# Altium project PSLink.PrjPcb (part 3 of 3)

## Sheet FMC.SchDoc
size 420 x 297 mm; SheetNumber: 3; SheetTotal: 6
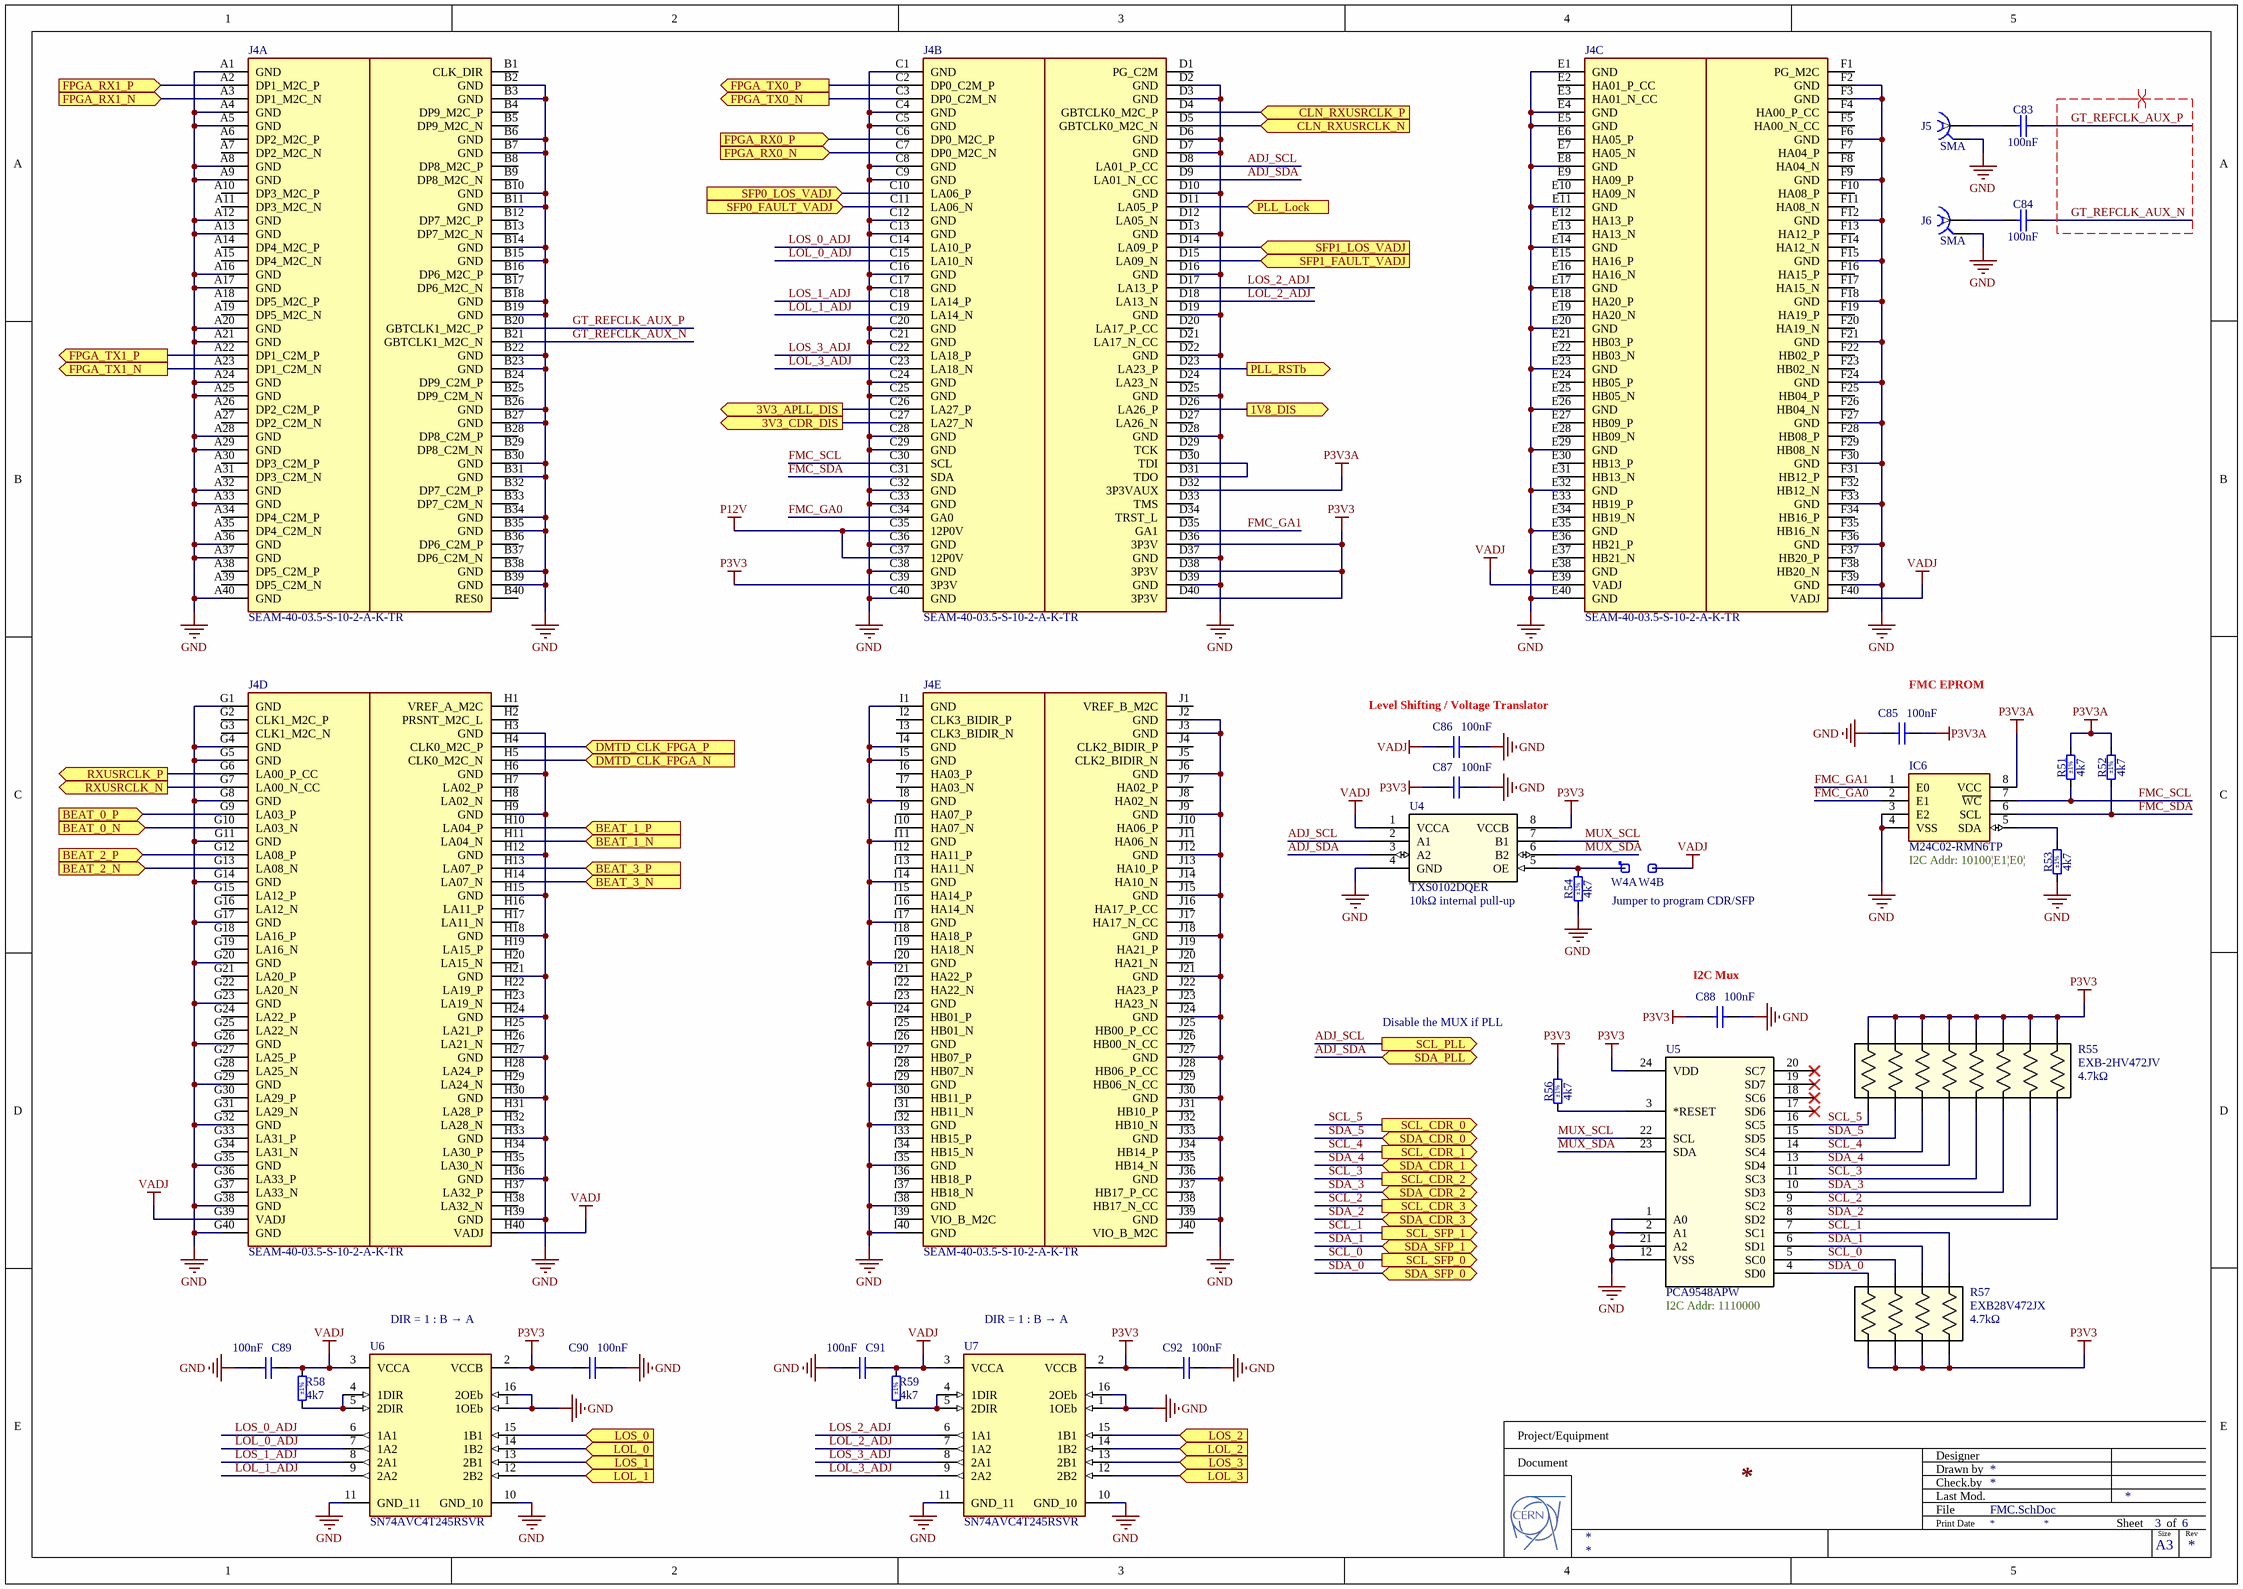
[diagram p5: FMC.SchDoc]

### Parts
C83  100nF  [CAPC0603X33N]
C84  100nF  [CAPC0603X33N]
C85  100nF  [CAPC0603X33N]
C86  100nF  [CAPC0603X33N]
C87  100nF  [CAPC0603X33N]
C88  100nF  [CAPC0603X33N]
C89  100nF  [CAPC0603X33N]
C90  100nF  [CAPC0603X33N]
C91  100nF  [CAPC0603X33N]
C92  100nF  [CAPC0603X33N]
IC6  M24C02-RMN6TP  [SOIC127P600X175-8N]
J4  SEAM-40-03.5-S-10-2-A-K-TR  [SAMTEC_SEAM-40-03.5-S-10-2-A-K-TR]  (parts A,B,C,D,E of 5)
J5  SMA  [SAMTEC_SMA-J-P-H-ST-MT1]
J6  SMA  [SAMTEC_SMA-J-P-H-ST-MT1]
R51  4k7  Tolerance: ±1%  [RESC1005X40N]
R52  4k7  Tolerance: ±1%  [RESC1005X40N]
R53  4k7  Tolerance: ±1%  [RESC1005X40N]
R54  4k7  Tolerance: ±1%  [RESC1005X40N]
R55  EXB-2HV472JV  [RES_EXB2HV]
R56  4k7  Tolerance: ±1%  [RESC1005X40N]
R57  EXB28V472JX  [C_ARRAY_EXB28V_PAN]
R58  4k7  Tolerance: ±1%  [RESC1005X40N]
R59  4k7  Tolerance: ±1%  [RESC1005X40N]
U4  TXS0102DQER  [DQE8_TEX]
U5  PCA9548APW  [SOT355-1_NXP]
U6  SN74AVC4T245RSVR  [QFN40P260X180X55-16N]
U7  SN74AVC4T245RSVR  [QFN40P260X180X55-16N]
W4  Header 2  [SAMTEC_HTSW-102-23-L-S]  (value not drawn)  (parts A,B of 2)

### Ports
1V8_DIS (out), 3V3_APLL_DIS (out), 3V3_CDR_DIS (out), BEAT_0_N (in), BEAT_0_P (in), BEAT_1_N (in), BEAT_1_P (in), BEAT_2_N (in), BEAT_2_P (in), BEAT_3_N (in), BEAT_3_P (in), CLN_RXUSRCLK_N (in), CLN_RXUSRCLK_P (in), DMTD_CLK_FPGA_N (in), DMTD_CLK_FPGA_P (in), FPGA_RX0_N (in), FPGA_RX0_P (in), FPGA_RX1_N (in), FPGA_RX1_P (in), FPGA_TX0_N (out), FPGA_TX0_P (out), FPGA_TX1_N (out), FPGA_TX1_P (out), LOL_0 (in), LOL_1 (in), LOL_2 (in), LOL_3 (in), LOS_0 (in), LOS_1 (in), LOS_2 (in), LOS_3 (in), PLL_Lock (in), PLL_RSTb (out), RXUSRCLK_N (out), RXUSRCLK_P (out), SCL_CDR_0 (out), SCL_CDR_1 (out), SCL_CDR_2 (out), SCL_CDR_3 (out), SCL_PLL (out), SCL_SFP_0 (out), SCL_SFP_1 (out), SDA_CDR_0 (bidir), SDA_CDR_1 (bidir), SDA_CDR_2 (bidir), SDA_CDR_3 (bidir), SDA_PLL (bidir), SDA_SFP_0 (bidir), SDA_SFP_1 (bidir), SFP0_FAULT_VADJ (in), SFP0_LOS_VADJ (in), SFP1_FAULT_VADJ (in), SFP1_LOS_VADJ (in)

### Nets
GND: C85.1 C86.1 C87.1 C88.1 C89.1 C90.1 C91.1 C92.1 IC6.3(E2) IC6.4(VSS) J4.A1(GND) J4.A4(GND) J4.A5(GND) J4.A8(GND) J4.A9(GND) J4.A12(GND) J4.A13(GND) J4.A16(GND) J4.A17(GND) J4.A20(GND) J4.A21(GND) J4.A24(GND) J4.A25(GND) J4.A28(GND) J4.A29(GND) J4.A32(GND) J4.A33(GND) J4.A36(GND) J4.A37(GND) J4.A40(GND) J4.B2(GND) J4.B3(GND) J4.B6(GND) J4.B7(GND) J4.B10(GND) J4.B11(GND) J4.B14(GND) J4.B15(GND) J4.B18(GND) J4.B19(GND) J4.B22(GND) J4.B23(GND) J4.B26(GND) J4.B27(GND) J4.B30(GND) J4.B31(GND) J4.B34(GND) J4.B35(GND) J4.B38(GND) J4.B39(GND) J4.C1(GND) J4.C4(GND) J4.C5(GND) J4.C8(GND) J4.C9(GND) J4.C12(GND) J4.C13(GND) J4.C16(GND) J4.C17(GND) J4.C20(GND) J4.C21(GND) J4.C24(GND) J4.C25(GND) J4.C28(GND) J4.C29(GND) J4.C32(GND) J4.C33(GND) J4.C36(GND) J4.C38(GND) J4.C40(GND) J4.D2(GND) J4.D3(GND) J4.D6(GND) J4.D7(GND) J4.D10(GND) J4.D13(GND) J4.D16(GND) J4.D19(GND) J4.D22(GND) J4.D25(GND) J4.D28(GND) J4.D37(GND) J4.D39(GND) J4.E1(GND) J4.E4(GND) J4.E5(GND) J4.E8(GND) J4.E11(GND) J4.E14(GND) J4.E17(GND) J4.E20(GND) J4.E23(GND) J4.E26(GND) J4.E29(GND) J4.E32(GND) J4.E35(GND) J4.E38(GND) J4.E40(GND) J4.F2(GND) J4.F3(GND) J4.F6(GND) J4.F9(GND) J4.F12(GND) J4.F15(GND) J4.F18(GND) J4.F21(GND) J4.F24(GND) J4.F27(GND) J4.F30(GND) J4.F33(GND) J4.F36(GND) J4.F39(GND) J4.G1(GND) J4.G4(GND) J4.G5(GND) J4.G8(GND) J4.G11(GND) J4.G14(GND) J4.G17(GND) J4.G20(GND) J4.G23(GND) J4.G26(GND) J4.G29(GND) J4.G32(GND) J4.G35(GND) J4.G38(GND) J4.G40(GND) J4.H3(GND) J4.H6(GND) J4.H9(GND) J4.H12(GND) J4.H15(GND) J4.H18(GND) J4.H21(GND) J4.H24(GND) J4.H27(GND) J4.H30(GND) J4.H33(GND) J4.H36(GND) J4.H39(GND) J4.I1(GND) J4.I4(GND) J4.I5(GND) J4.I8(GND) J4.I11(GND) J4.I14(GND) J4.I17(GND) J4.I20(GND) J4.I23(GND) J4.I26(GND) J4.I29(GND) J4.I32(GND) J4.I35(GND) J4.I38(GND) J4.I40(GND) J4.J2(GND) J4.J3(GND) J4.J6(GND) J4.J9(GND) J4.J12(GND) J4.J15(GND) J4.J18(GND) J4.J21(GND) J4.J24(GND) J4.J27(GND) J4.J30(GND) J4.J33(GND) J4.J36(GND) J4.J39(GND) J5.2 J6.2 R53.1 R54.1 U4.4(GND) U5.1(A0) U5.2(A1) U5.12(VSS) U5.21(A2) U6.1(1OEb) U6.10(GND_10) U6.11(GND_11) U6.16(2OEb) U7.1(1OEb) U7.10(GND_10) U7.11(GND_11) U7.16(2OEb)
P3V3: C87.2 C88.2 C90.2 C92.2 J4.C39(3P3V) J4.D36(3P3V) J4.D38(3P3V) J4.D40(3P3V) R55.9 R55.10 R55.11 R55.12 R55.13 R55.14 R55.15 R55.16 R56.2 R57.1 R57.2 R57.3 R57.4 U4.8(VCCB) U5.24(VDD) U6.2(VCCB) U7.2(VCCB)
P3V3A: C85.2 IC6.8(VCC) J4.D32(3P3VAUX) R51.2 R52.2
P12V: J4.C35(12P0V) J4.C37(12P0V)
VADJ: C86.2 C89.2 C91.2 J4.E39(VADJ) J4.F40(VADJ) J4.G39(VADJ) J4.H40(VADJ) R58.2 R59.2 U4.1(VCCA) U6.3(VCCA) U7.3(VCCA) W4.2
1V8_DIS: J4.D26(LA26_P) ; port 1V8_DIS
3V3_APLL_DIS: J4.C26(LA27_P) ; port 3V3_APLL_DIS
3V3_CDR_DIS: J4.C27(LA27_N) ; port 3V3_CDR_DIS
ADJ_SCL: J4.D8(LA01_P_CC) U4.2(A1) ; port SCL_PLL
ADJ_SDA: J4.D9(LA01_N_CC) U4.3(A2) ; port SDA_PLL
BEAT_0_N: J4.G10(LA03_N) ; port BEAT_0_N
BEAT_0_P: J4.G9(LA03_P) ; port BEAT_0_P
BEAT_1_N: J4.H11(LA04_N) ; port BEAT_1_N
BEAT_1_P: J4.H10(LA04_P) ; port BEAT_1_P
BEAT_2_N: J4.G13(LA08_N) ; port BEAT_2_N
BEAT_2_P: J4.G12(LA08_P) ; port BEAT_2_P
BEAT_3_N: J4.H14(LA07_N) ; port BEAT_3_N
BEAT_3_P: J4.H13(LA07_P) ; port BEAT_3_P
CLN_RXUSRCLK_N: J4.D5(GBTCLK0_M2C_N) ; port CLN_RXUSRCLK_N
CLN_RXUSRCLK_P: J4.D4(GBTCLK0_M2C_P) ; port CLN_RXUSRCLK_P
DMTD_CLK_FPGA_N: J4.H5(CLK0_M2C_N) ; port DMTD_CLK_FPGA_N
DMTD_CLK_FPGA_P: J4.H4(CLK0_M2C_P) ; port DMTD_CLK_FPGA_P
FMC_GA0: IC6.2(E1) J4.C34(GA0)
FMC_GA1: IC6.1(E0) J4.D35(GA1)
FMC_SCL: IC6.7(~{WC}) J4.C30(SCL) R51.1
FMC_SDA: IC6.6(SCL) J4.C31(SDA) R52.1
FPGA_RX0_N: J4.C7(DP0_M2C_N) ; port FPGA_RX0_N
FPGA_RX0_P: J4.C6(DP0_M2C_P) ; port FPGA_RX0_P
FPGA_RX1_N: J4.A3(DP1_M2C_N) ; port FPGA_RX1_N
FPGA_RX1_P: J4.A2(DP1_M2C_P) ; port FPGA_RX1_P
FPGA_TX0_N: J4.C3(DP0_C2M_N) ; port FPGA_TX0_N
FPGA_TX0_P: J4.C2(DP0_C2M_P) ; port FPGA_TX0_P
FPGA_TX1_N: J4.A23(DP1_C2M_N) ; port FPGA_TX1_N
FPGA_TX1_P: J4.A22(DP1_C2M_P) ; port FPGA_TX1_P
GT_REFCLK_AUX_N: C84.1 J4.B21(GBTCLK1_M2C_N)
GT_REFCLK_AUX_P: C83.1 J4.B20(GBTCLK1_M2C_P)
Lock: J4.D11(LA05_P) ; port PLL_Lock
LOL: U7.13(2B1) ; port LOS_3
LOL: U7.15(1B1) ; port LOS_2  [a separate net that carries the same name]
LOL: U6.13(2B1) ; port LOS_1  [a separate net that carries the same name]
LOL: U6.15(1B1) ; port LOS_0  [a separate net that carries the same name]
LOL_0: U6.14(1B2) ; port LOL_0
LOL_0_ADJ: J4.C15(LA10_N) U6.7(1A2)
LOL_1: U6.12(2B2) ; port LOL_1
LOL_1_ADJ: J4.C19(LA14_N) U6.9(2A2)
LOL_2: U7.14(1B2) ; port LOL_2
LOL_2_ADJ: J4.D18(LA13_N) U7.7(1A2)
LOL_3: U7.12(2B2) ; port LOL_3
LOL_3_ADJ: J4.C23(LA18_N) U7.9(2A2)
LOS_0_ADJ: J4.C14(LA10_P) U6.6(1A1)
LOS_1_ADJ: J4.C18(LA14_P) U6.8(2A1)
LOS_2_ADJ: J4.D17(LA13_P) U7.6(1A1)
LOS_3_ADJ: J4.C22(LA18_P) U7.8(2A1)
MUX_SCL: U4.7(B1) U5.22(SCL)
MUX_SDA: U4.6(B2) U5.23(SDA)
PLL_RSTb: J4.D23(LA23_P) ; port PLL_RSTb
RXUSRCLK_N: J4.G7(LA00_N_CC) ; port RXUSRCLK_N
RXUSRCLK_P: J4.G6(LA00_P_CC) ; port RXUSRCLK_P
SCL_0: R57.7 U5.5(SC0) ; port SCL_SFP_0  [project net SCL0]
SCL_1: R57.5 U5.7(SC1) ; port SCL_SFP_1  [project net SCL1]
SCL_2: R55.7 U5.9(SC2) ; port SCL_CDR_3
SCL_3: R55.5 U5.11(SC3) ; port SCL_CDR_2
SCL_4: R55.3 U5.14(SC4) ; port SCL_CDR_1
SCL_5: R55.1 U5.16(SC5) ; port SCL_CDR_0
SDA_0: R57.8 U5.4(SD0) ; port SDA_SFP_0  [project net SDA0]
SDA_1: R57.6 U5.6(SD1) ; port SDA_SFP_1  [project net SDA1]
SDA_2: R55.8 U5.8(SD2) ; port SDA_CDR_3
SDA_3: R55.6 U5.10(SD3) ; port SDA_CDR_2
SDA_4: R55.4 U5.13(SD4) ; port SDA_CDR_1
SDA_5: R55.2 U5.15(SD5) ; port SDA_CDR_0
SFP0_FAULT_VADJ: J4.C11(LA06_N) ; port SFP0_FAULT_VADJ
SFP0_LOS_VADJ: J4.C10(LA06_P) ; port SFP0_LOS_VADJ
SFP1_FAULT_VADJ: J4.D15(LA09_N) ; port SFP1_FAULT_VADJ
SFP1_LOS_VADJ: J4.D14(LA09_P) ; port SFP1_LOS_VADJ
NetC83_2: C83.2 J5.1
NetC84_2: C84.2 J6.1
NetIC6_5: IC6.5(SDA) R53.2
NetJ4_D30: J4.D30(TDI) J4.D31(TDO)
NetR54_2: R54.2 U4.5(OE) W4.1
NetR56_1: R56.1 U5.3(*RESET)
NetR58_1: R58.1 U6.4(1DIR) U6.5(2DIR)
NetR59_1: R59.1 U7.4(1DIR) U7.5(2DIR)

Not connected (* = marked no-connect by the designer): J4 A6(DP2_M2C_P) A7(DP2_M2C_N) A10(DP3_M2C_P) A11(DP3_M2C_N) A14(DP4_M2C_P) A15(DP4_M2C_N) A18(DP5_M2C_P) A19(DP5_M2C_N) A26(DP2_C2M_P) A27(DP2_C2M_N) A30(DP3_C2M_P) A31(DP3_C2M_N) A34(DP4_C2M_P) A35(DP4_C2M_N) A38(DP5_C2M_P) A39(DP5_C2M_N) B1(CLK_DIR) B4(DP9_M2C_P) B5(DP9_M2C_N) B8(DP8_M2C_P) B9(DP8_M2C_N) B12(DP7_M2C_P) B13(DP7_M2C_N) B16(DP6_M2C_P) B17(DP6_M2C_N) B24(DP9_C2M_P) B25(DP9_C2M_N) B28(DP8_C2M_P) B29(DP8_C2M_N) B32(DP7_C2M_P) B33(DP7_C2M_N) B36(DP6_C2M_P) B37(DP6_C2M_N) B40(RES0) D1(PG_C2M) D12(LA05_N) D20(LA17_P_CC) D21(LA17_N_CC) D24(LA23_N) D27(LA26_N) D29(TCK) D33(TMS) D34(TRST_L) E2(HA01_P_CC) E3(HA01_N_CC) E6(HA05_P) E7(HA05_N) E9(HA09_P) E10(HA09_N) E12(HA13_P) E13(HA13_N) E15(HA16_P) E16(HA16_N) E18(HA20_P) E19(HA20_N) E21(HB03_P) E22(HB03_N) E24(HB05_P) E25(HB05_N) E27(HB09_P) E28(HB09_N) E30(HB13_P) E31(HB13_N) E33(HB19_P) E34(HB19_N) E36(HB21_P) E37(HB21_N) F1(PG_M2C) F4(HA00_P_CC) F5(HA00_N_CC) F7(HA04_P) F8(HA04_N) F10(HA08_P) F11(HA08_N) F13(HA12_P) F14(HA12_N) F16(HA15_P) F17(HA15_N) F19(HA19_P) F20(HA19_N) F22(HB02_P) F23(HB02_N) F25(HB04_P) F26(HB04_N) F28(HB08_P) F29(HB08_N) F31(HB12_P) F32(HB12_N) F34(HB16_P) F35(HB16_N) F37(HB20_P) F38(HB20_N) G2(CLK1_M2C_P) G3(CLK1_M2C_N) G15(LA12_P) G16(LA12_N) G18(LA16_P) G19(LA16_N) G21(LA20_P) G22(LA20_N) G24(LA22_P) G25(LA22_N) G27(LA25_P) G28(LA25_N) G30(LA29_P) G31(LA29_N) G33(LA31_P) G34(LA31_N) G36(LA33_P) G37(LA33_N) H1(VREF_A_M2C) H2(PRSNT_M2C_L) H7(LA02_P) H8(LA02_N) H16(LA11_P) H17(LA11_N) H19(LA15_P) H20(LA15_N) H22(LA19_P) H23(LA19_N) H25(LA21_P) H26(LA21_N) H28(LA24_P) H29(LA24_N) H31(LA28_P) H32(LA28_N) H34(LA30_P) H35(LA30_N) H37(LA32_P) H38(LA32_N) I2(CLK3_BIDIR_P) I3(CLK3_BIDIR_N) I6(HA03_P) I7(HA03_N) I9(HA07_P) I10(HA07_N) I12(HA11_P) I13(HA11_N) I15(HA14_P) I16(HA14_N) I18(HA18_P) I19(HA18_N) I21(HA22_P) I22(HA22_N) I24(HB01_P) I25(HB01_N) I27(HB07_P) I28(HB07_N) I30(HB11_P) I31(HB11_N) I33(HB15_P) I34(HB15_N) I36(HB18_P) I37(HB18_N) I39(VIO_B_M2C) J1(VREF_B_M2C) J4(CLK2_BIDIR_P) J5(CLK2_BIDIR_N) J7(HA02_P) J8(HA02_N) J10(HA06_P) J11(HA06_N) J13(HA10_P) J14(HA10_N) J16(HA17_P_CC) J17(HA17_N_CC) J19(HA21_P) J20(HA21_N) J22(HA23_P) J23(HA23_N) J25(HB00_P_CC) J26(HB00_N_CC) J28(HB06_P_CC) J29(HB06_N_CC) J31(HB10_P) J32(HB10_N) J34(HB14_P) J35(HB14_N) J37(HB17_P_CC) J38(HB17_N_CC) J40(VIO_B_M2C); U5 17(SD6)* 18(SC6)* 19(SD7)* 20(SC7)*

### Layout directives
differential pair: GT_REFCLK_AUX_N, GT_REFCLK_AUX_P

### Notes on the sheet
- (near C86) Level Shifting / Voltage Translator
- (near C85) FMC EPROM
- (near R53) I2C Addr: 10100|E1|E0|
- 10kΩ internal pull-up
- (near W4) Jumper to program CDR/SFP
- (near C88) I2C Mux
- Disable the MUX if PLL
- (near R55) 4.7kΩ
- (near U6) DIR = 1 : B → A
- (near U7) DIR = 1 : B → A
- (near U5) I2C Addr: 1110000
- (near R57) 4.7kΩ
- Project/Equipment
- Document
- Designer
- Drawn by
- Check.by
- File
- Last Mod.
- Print Date
- Sheet
- Size
- A3
- of
- Rev

### Library data of the parts
C83 C84 = CC0201_100NF_6.3V_10%_X7R: Non-polarised capacitor; Part Description: SMD Multilayer Chip Ceramic Capacitor; Manufacturer: GENERIC; Manufacturer1 Part Number: CC0201KRX7R5BB104; Voltage: 6.3V; TC: X7R; Tolerance: ±10%; Part Number: CC0201_100NF_6.3V_10%_X7R; Component Kind: Standard; Component Type: Standard; Pin Count: 2; Value: 100nF; Status: Not Recommended; Manufacturer Part Number: CC0201_100NF_6.3V_10%_X7R; Case: 0201; Mounted: Yes; Socket: No; SMD: Yes; Sense: No; Manufacturer1 Example: YAGEO PHYCOMP; Manufacturer1 ComponentHeight: 0.33mm; HelpURL: \\cern.ch\dfs\Applications\Altium\Datasheets\CC0201_X7R_YAGEO_6.3VTO50V.pdf; Author: CERN DEM BC; CreateDate: 11/20/2020; LatestRevisionDate: 11/20/2020
C85-C92 = CC0201_100NF_6.3V_10%_X5R: GRM033R61C104KE14; Part Description: SMD Multilayer Chip Ceramic Capacitor; Manufacturer: GENERIC; Manufacturer1 Part Number: 02016D104KAT2A; Voltage: 6.3V; TC: X5R; Tolerance: ±10%; Part Number: CC0201_100NF_6.3V_10%_X5R; Component Kind: Standard; Component Type: Standard; Pin Count: 2; Value: 100nF; Status: Not Recommended; Manufacturer Part Number: CC0201_100NF_6.3V_10%_X5R; Case: 0201; Mounted: Yes; Socket: No; SMD: Yes; Sense: No; Manufacturer1 Example: AVX; Manufacturer1 ComponentHeight: 0.33mm; HelpURL: \\cern.ch\dfs\Applications\Altium\Datasheets\CC0201_X5R_AVX.pdf; Author: CERN DEM JLC; CreateDate: 12/3/2007; LatestRevisionDate: 12/3/2007
IC6 = M24C02-RMN6TP: Integrated Circuit; Manufacturer_Name: STMicroelectronics; Datasheet Link: http://www.st.com/st-web-ui/static/active/en/resource/technical/document/datasheet/DM00071904.pdf; Height: 1.75mm; Manufacturer_Part_Number: M24C02-RMN6TP; Mouser Part Number: 511-M24C02-RMN6TP; Mouser Price/Stock: https://www.mouser.co.uk/ProductDetail/STMicroelectronics/M24C02-RMN6TP?qs=Jodr3Ka7a6ktinv3aZzndw%3D%3D; Arrow Part Number: M24C02-RMN6TP; Arrow Price/Stock: https://www.arrow.com/en/products/m24c02-rmn6tp/stmicroelectronics?region=nac
J4 = SEAM-40-03.5-S-10-2-A-K-TR: MF: Samtec; Value: *; Package: None; Price: None; MP: SEAM-40-03.5-S-10-2-A-K-TR; Availability: Unavailable
J5 J6 = SAMTEC_SMA-J-P-H-ST-MT1: Part Description: 50 Ohms SMA Straight Mixed Technology PCB Jack; Manufacturer: SAMTEC; PressFit: No; Sense Comment: assembly limitations; Part Number: SAMTEC_SMA-J-P-H-ST-MT1; Component Kind: Standard; Component Type: Standard; Pin Count: 5; Family: SMA; Mounted: Yes; Socket: No; SMD: Yes; Sense: Yes; Status: Not Recommended; Manufacturer Part Number: SMA-J-P-H-ST-MT1; ComponentHeight: 7.95mm; HelpURL: \\cern.ch\dfs\Applications\Altium\Datasheets\SAMTEC_SMA-J-P-H-ST-MT1.pdf; Author: CERN DEM HF; CreateDate: 5/24/2023; LatestRevisionDate: 5/24/2023
R51-R54 R56 R58 R59 = R0402_4K7_1%_0.0625W_100PPM: Resistor - 1%; Part Description: General Purpose Thick Film Chip Resistor; Manufacturer: GENERIC; Manufacturer1 Part Number: 232270674702L; TC: ±100ppm/°C; PressFit: No; Part Number: R0402_4K7_1%_0.0625W_100PPM; Component Kind: Standard; Component Type: Standard; Pin Count: 2; Value: 4k7; Status: Not Recommended; Power: 0.0625W; Manufacturer Part Number: R0402_4K7_1%_0.0625W_100PPM; Case: 0402; Mounted: Yes; Sense: No; Socket: No; SMD: Yes; Manufacturer1 Example: YAGEO PHYCOMP; Manufacturer1 ComponentHeight: 0.4mm; HelpURL: \\cern.ch\dfs\Applications\Altium\Datasheets\R0402_Phycomp_RC0402.pdf; Author: CERN DEM JLC; CreateDate: 12/3/2007; LatestRevisionDate: 10/17/2012
R55 = EXB-2HV472JV: No Description Available; Mfr_Name: Panasonic
R57 = EXB28V472JX: No Description Available; Mfr_Name: Panasonic; RefDes: RefDes; Type: Type
U4 = TXS0102DQER: No Description Available; Mfr_Name: Texas Instruments; RefDes: RefDes; Type: Type
U5 = PCA9548APW: No Description Available; Mfr_Name: NXP; Digi-Key_Part_Number_6: 296-33511-5-ND; Digi-Key_Part_Number_5: 2156-PCA9548APW-ND; Digi-Key_Part_Number_1: 568-10297-1-ND; Digi-Key_Part_Number_2: 568-10297-2-ND; Digi-Key_Part_Number_3: 568-10297-6-ND; Digi-Key_Part_Number_4: 568-3384-5-ND; RefDes: RefDes; Type: Type
U6 U7 = SN74AVC4T245RSVR: 4-Bit Dual-Supply Bus Transceiver with Configurable Voltage-Level Shifting and 3-State Outputs 16-UQFN -40 to 85; MF: Texas Instruments; Purchase-URL: https://pricing.snapeda.com/search/part/SN74AVC4T245RSVR/?ref=eda; Price: None; SnapEDA_Link: https://www.snapeda.com/parts/SN74AVC4T245RSVR/Texas%20Instruments/view-part/553822/?ref=snap; Package: UQFN-16 Texas Instruments; Availability: Good; Value: *; MP: SN74AVC4T245RSVR
W4 = SAMTEC_HTSW-102-23-L-S: 2 Mini Wire-Wrap Contact Strip Header; Part Description: 2 Contacts, Pitch 2.54mm, Single Row  Through Mount Straight Header (Post Lead 5.84mm, Tail Lead 2.92mm, Insulator 2.54mm); Manufacturer: SAMTEC; PressFit: No; Status Comment: High Temperature; Part Number: SAMTEC_HTSW-102-23-L-S; Component Kind: Standard; Component Type: Standard; Pin Count: 2; Family: Header 2; Mounted: Yes; Socket: No; SMD: No; Sense: No; Status: Preferred; Manufacturer Part Number: HTSW-102-23-L-S; ComponentHeight: 8.38mm; HelpURL: \\cern.ch\dfs\Applications\Altium\Datasheets\SAMTEC_HTSW-102-23-L-S.pdf; Author: CERN DEM JLC; CreateDate: 2/22/2018; LatestRevisionDate: 2/22/2018

## Nets that join several sheets
1V8: PLL (27 pins), U_Channel_3 (19 pins), U_Channel_2 (19 pins), U_Channel_1 (19 pins), U_Channel_0 (19 pins), power-sheet (6 pins)
3V3APLL: PLL (C114.2 IC7.13 R67.2), power-sheet (5 pins)
3V3CDR: U_Channel_3 (28 pins), U_Channel_2 (28 pins), U_Channel_1 (28 pins), U_Channel_0 (28 pins), power-sheet (5 pins)
GND: SFP (101 pins), PLL (28 pins), U_Channel_3 (50 pins), U_Channel_2 (50 pins), U_Channel_1 (50 pins), U_Channel_0 (50 pins), power-sheet (44 pins), FMC (186 pins)
P3V3: SFP (10 pins), power-sheet (5 pins), FMC (25 pins)
P12V: power-sheet (C49.2 C50.2 R16.2 U2.1), FMC (J4.C35 J4.C37)
VADJ: SFP (C81.2 R50.2 U3.3), FMC (13 pins)
VREFAC: U_Channel_3 (8 pins), U_Channel_2 (8 pins), U_Channel_1 (8 pins), U_Channel_0 (8 pins), power-sheet (R22.1 R25.2)
1V8_DIS: power-sheet (Q6.1 R33.2), FMC (J4.D26)
3V3_APLL_DIS: power-sheet (Q3.1 R13.2), FMC (J4.C26)
3V3_CDR_DIS: power-sheet (Q4.1 R28.2), FMC (J4.C27)
ADJ_SCL: PLL (W6.2), FMC (J4.D8 U4.2)
ADJ_SDA: PLL (W7.2), FMC (J4.D9 U4.3)
BEAT_0_N: U_Channel_0 (IC1_U_Channel_0.10), FMC (J4.G10)
BEAT_0_P: U_Channel_0 (IC1_U_Channel_0.11), FMC (J4.G9)
BEAT_1_N: U_Channel_1 (IC1_U_Channel_1.10), FMC (J4.H11)
BEAT_1_P: U_Channel_1 (IC1_U_Channel_1.11), FMC (J4.H10)
BEAT_2_N: U_Channel_2 (IC1_U_Channel_2.10), FMC (J4.G13)
BEAT_2_P: U_Channel_2 (IC1_U_Channel_2.11), FMC (J4.G12)
BEAT_3_N: U_Channel_3 (IC1_U_Channel_3.10), FMC (J4.H14)
BEAT_3_P: U_Channel_3 (IC1_U_Channel_3.11), FMC (J4.H13)
CLN_RXUSRCLK_N: PLL (C94.2), FMC (J4.D5)
CLN_RXUSRCLK_P: PLL (C93.2), FMC (J4.D4)
DMTD_CLK_0_N: PLL (C104.2), U_Channel_0 (IC1_U_Channel_0.7)
DMTD_CLK_0_P: PLL (C102.2), U_Channel_0 (IC1_U_Channel_0.6)
DMTD_CLK_1_N: PLL (C106.2), U_Channel_1 (IC1_U_Channel_1.7)
DMTD_CLK_1_P: PLL (C105.2), U_Channel_1 (IC1_U_Channel_1.6)
DMTD_CLK_2_N: PLL (C111.2), U_Channel_2 (IC1_U_Channel_2.7)
DMTD_CLK_2_P: PLL (C109.2), U_Channel_2 (IC1_U_Channel_2.6)
DMTD_CLK_3_N: PLL (C113.2), U_Channel_3 (IC1_U_Channel_3.7)
DMTD_CLK_3_P: PLL (C112.2), U_Channel_3 (IC1_U_Channel_3.6)
DMTD_CLK_FPGA_N: PLL (C119.2), FMC (J4.H5)
DMTD_CLK_FPGA_P: PLL (C118.2), FMC (J4.H4)
FPGA_RX0_N: U_Channel_0 (C39_U_Channel_0.2), FMC (J4.C7)
FPGA_RX0_P: U_Channel_0 (C38_U_Channel_0.2), FMC (J4.C6)
FPGA_RX1_N: U_Channel_2 (C39_U_Channel_2.2), FMC (J4.A3)
FPGA_RX1_P: U_Channel_2 (C38_U_Channel_2.2), FMC (J4.A2)
FPGA_TX0_N: U_Channel_3 (IC2_U_Channel_3.4), FMC (J4.C3)
FPGA_TX0_P: U_Channel_3 (IC2_U_Channel_3.1), FMC (J4.C2)
FPGA_TX1_N: U_Channel_1 (IC2_U_Channel_1.4), FMC (J4.A23)
FPGA_TX1_P: U_Channel_1 (IC2_U_Channel_1.1), FMC (J4.A22)
Lock: PLL (IC7.47 R68.1), FMC (J4.D11)
LOL: U_Channel_3 (R9_U_Channel_3.1 U1_U_Channel_3.16), FMC (U7.13)
LOL: U_Channel_2 (R9_U_Channel_2.1 U1_U_Channel_2.16), FMC (U7.15)
LOL: U_Channel_1 (R9_U_Channel_1.1 U1_U_Channel_1.16), FMC (U6.13)
LOL: U_Channel_0 (R9_U_Channel_0.1 U1_U_Channel_0.16), FMC (U6.15)
LOL_0: U_Channel_0 (R8_U_Channel_0.1 U1_U_Channel_0.22), FMC (U6.14)
LOL_1: U_Channel_1 (R8_U_Channel_1.1 U1_U_Channel_1.22), FMC (U6.12)
LOL_2: U_Channel_2 (R8_U_Channel_2.1 U1_U_Channel_2.22), FMC (U7.14)
LOL_3: U_Channel_3 (R8_U_Channel_3.1 U1_U_Channel_3.22), FMC (U7.12)
PLL_RSTb: PLL (IC7.6), FMC (J4.D23)
RXUSRCLK_N: PLL (C103.2), FMC (J4.G7)
RXUSRCLK_P: PLL (C101.2), FMC (J4.G6)
SCL0: SFP (J2.5), FMC (R57.7 U5.5)
SCL1: SFP (J3.5), FMC (R57.5 U5.7)
SCL_2: U_Channel_3 (U1_U_Channel_3.20), FMC (R55.7 U5.9)
SCL_3: U_Channel_2 (U1_U_Channel_2.20), FMC (R55.5 U5.11)
SCL_4: U_Channel_1 (U1_U_Channel_1.20), FMC (R55.3 U5.14)
SCL_5: U_Channel_0 (U1_U_Channel_0.20), FMC (R55.1 U5.16)
SDA0: SFP (J2.4), FMC (R57.8 U5.4)
SDA1: SFP (J3.4), FMC (R57.6 U5.6)
SDA_2: U_Channel_3 (U1_U_Channel_3.21), FMC (R55.8 U5.8)
SDA_3: U_Channel_2 (U1_U_Channel_2.21), FMC (R55.6 U5.10)
SDA_4: U_Channel_1 (U1_U_Channel_1.21), FMC (R55.4 U5.13)
SDA_5: U_Channel_0 (U1_U_Channel_0.21), FMC (R55.2 U5.15)
SFP0_FAULT_VADJ: SFP (U3.7), FMC (J4.C11)
SFP0_LOS_VADJ: SFP (U3.6), FMC (J4.C10)
SFP1_FAULT_VADJ: SFP (U3.9), FMC (J4.D15)
SFP1_LOS_VADJ: SFP (U3.8), FMC (J4.D14)
SFP_RX0_N: SFP (J2.12), U_Channel_0 (IC2_U_Channel_0.4)
SFP_RX0_P: SFP (J2.13), U_Channel_0 (IC2_U_Channel_0.1)
SFP_RX1_N: SFP (J3.12), U_Channel_2 (IC2_U_Channel_2.4)
SFP_RX1_P: SFP (J3.13), U_Channel_2 (IC2_U_Channel_2.1)
SFP_TX0_N: SFP (J2.19), U_Channel_3 (C39_U_Channel_3.2)
SFP_TX0_P: SFP (J2.18), U_Channel_3 (C38_U_Channel_3.2)
SFP_TX1_N: SFP (J3.19), U_Channel_1 (C39_U_Channel_1.2)
SFP_TX1_P: SFP (J3.18), U_Channel_1 (C38_U_Channel_1.2)